# Altium schematic sheet uC.SchDoc: uC
size A3; SheetNumber: 4
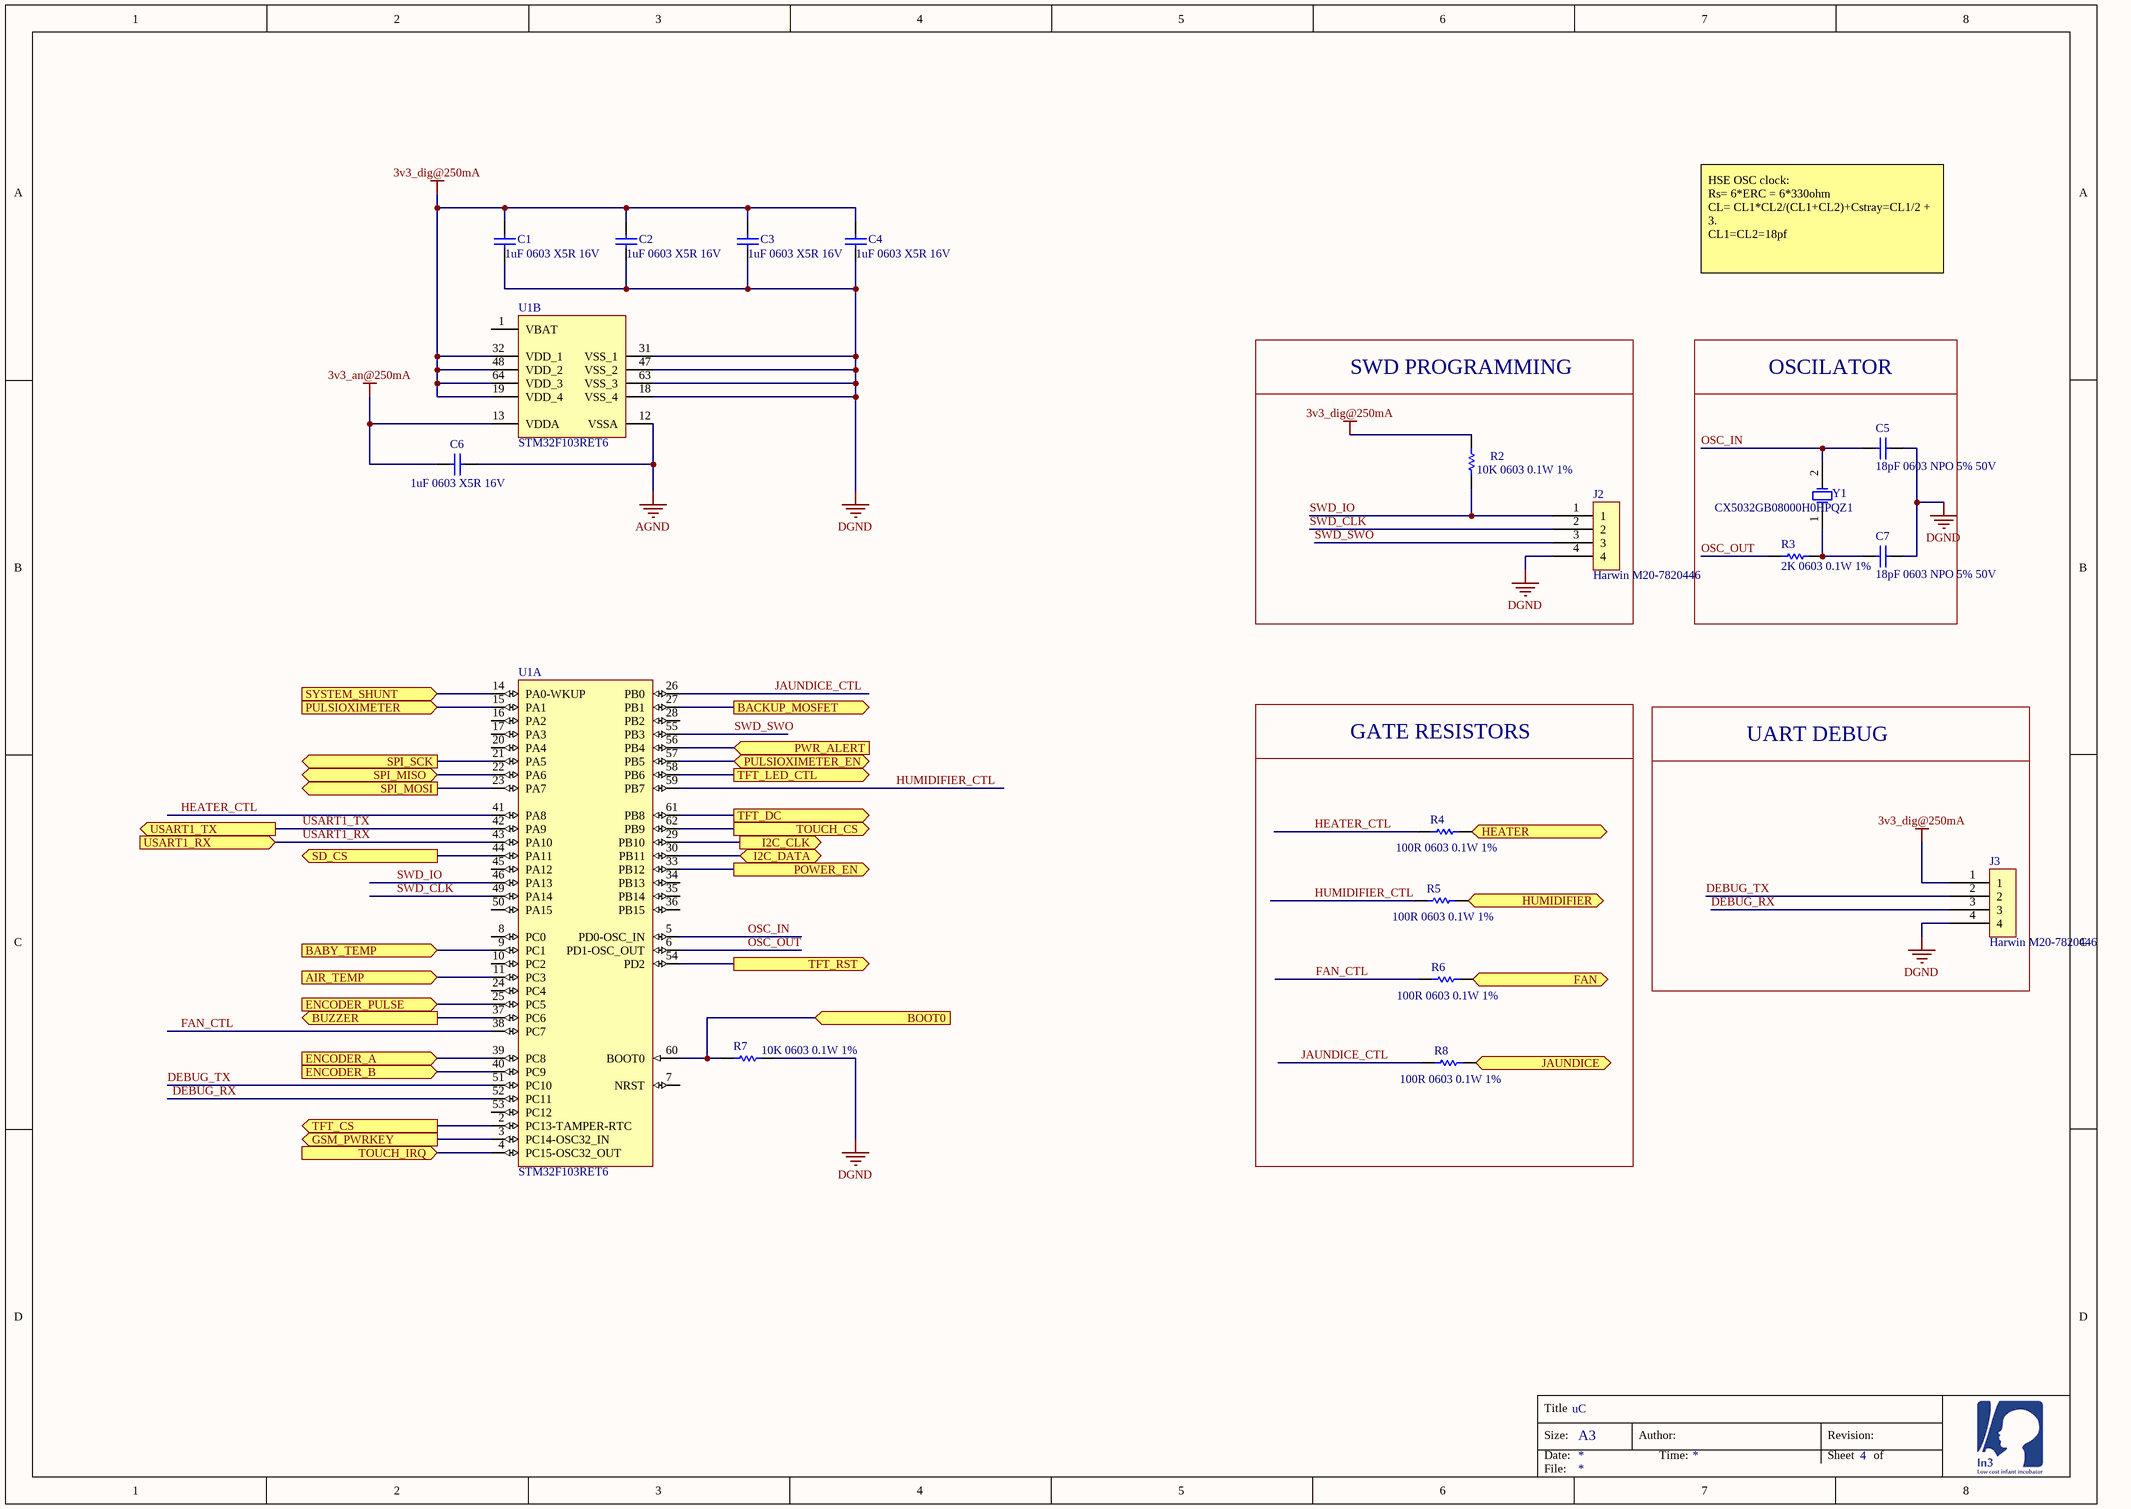
[diagram p0: uC.SchDoc]

## Parts
(Parts that share a designator on the sheet are numbered #1, #2 ... from top to bottom, then left to right.)
C1  1uF 0603 X5R 16V  [CAPC1608X60X35NL10T15]
C2  1uF 0603 X5R 16V  [CAPC1608X60X35NL10T15]
C3  1uF 0603 X5R 16V  [CAPC1608X60X35NL10T15]
C4  1uF 0603 X5R 16V  [CAPC1608X60X35NL10T15]
C5  18pF 0603 NPO 5% 50V  [CAPC1608X60X35NL10T15]
C6  1uF 0603 X5R 16V  [CAPC1608X60X35ML10T15]
C7  18pF 0603 NPO 5% 50V  [CAPC1608X60X35NL10T15]
J2  Harwin M20-7820446  [PCB-tt6oa92k1i3euqam155k-1]
J3  Harwin M20-7820446  [PCB-tt6oa92k1i3euqam155k-1]
R2  10K 0603 0.1W 1%  [RESC1609X55X30ML10T20]
R3  2K 0603 0.1W 1%  [RESC1609X55X30ML10T20]
R4  100R 0603 0.1W 1%  [RESC1609X55X30ML10T20]
R5  100R 0603 0.1W 1%  [RESC1609X55X30ML10T20]
R6  100R 0603 0.1W 1%  [RESC1609X55X30ML10T20]
R7  10K 0603 0.1W 1%  [RESC1609X55X30ML10T20]
R8  100R 0603 0.1W 1%  [RESC1609X55X30ML10T20]
U1#1  STM32F103RET6  [STM-LQFP64_L]  (part B of 2)
U1#2  STM32F103RET6  [STM-LQFP64_L]  (part A of 2)
Y1  CX5032GB08000H0HPQZ1  [PCB-mm1uo60gbc5oxcl0fq61-1]

## Blocks framed on the sheet
SWD PROGRAMMING: J2 R2
OSCILATOR: C5 C7 R3 Y1
GATE RESISTORS: R4-R6 R8
UART DEBUG: J3

## Ports
AIR_TEMP (in), BABY_TEMP (in), BACKUP_MOSFET (out), BOOT0 (in), BUZZER (out), ENCODER_A (in), ENCODER_B (in), ENCODER_PULSE (in), FAN (out), GSM_PWRKEY (out), HEATER (out), HUMIDIFIER (out), I2C_CLK (out), I2C_DATA (bidir), JAUNDICE (out), POWER_EN (out), PULSIOXIMETER (in), PULSIOXIMETER_EN, PWR_ALERT (in), SD_CS (out), SPI_MISO, SPI_MOSI (out), SPI_SCK (out), SYSTEM_SHUNT (in), TFT_CS (out), TFT_DC (out), TFT_LED_CTL (out), TFT_RST (out), TOUCH_CS (out), TOUCH_IRQ (in), USART1_RX (in), USART1_TX (out)

## Nets
3v3_an@250mA: C6.1 U1#1.13(VDDA)
3v3_dig@250mA: C1.1 C2.1 C3.1 C4.1 J3.1 R2.1 U1#1.19(VDD_4) U1#1.32(VDD_1) U1#1.48(VDD_2) U1#1.64(VDD_3)
AGND: C6.2 U1#1.12(VSSA)
DGND: C1.2 C2.2 C3.2 C4.2 C5.2 C7.2 J2.4 J3.4 R7.2 U1#1.18(VSS_4) U1#1.31(VSS_1) U1#1.47(VSS_2) U1#1.63(VSS_3)
AIR_TEMP: U1#2.11(PC3) ; port AIR_TEMP
BABY_TEMP: U1#2.9(PC1) ; port BABY_TEMP
BACKUP_MOSFET: U1#2.27(PB1) ; port BACKUP_MOSFET
BOOT0: R7.1 U1#2.60(BOOT0) ; port BOOT0
BUZZER: U1#2.37(PC6) ; port BUZZER
DEBUG_RX: J3.3 U1#2.52(PC11)
DEBUG_TX: J3.2 U1#2.51(PC10)
ENCODER_A: U1#2.39(PC8) ; port ENCODER_A
ENCODER_B: U1#2.40(PC9) ; port ENCODER_B
ENCODER_PULSE: U1#2.25(PC5) ; port ENCODER_PULSE
FAN: R6.1 ; port FAN
FAN_CTL: R6.2 U1#2.38(PC7)
GSM_PWRKEY: U1#2.3(PC14-OSC32_IN) ; port GSM_PWRKEY
HEATER: R4.1 ; port HEATER
HEATER_CTL: R4.2 U1#2.41(PA8)
HUMIDIFIER: R5.1 ; port HUMIDIFIER
HUMIDIFIER_CTL: R5.2 U1#2.59(PB7)
I2C_CLK: U1#2.29(PB10) ; port I2C_CLK
I2C_DATA: U1#2.30(PB11) ; port I2C_DATA
JAUNDICE: R8.1 ; port JAUNDICE
JAUNDICE_CTL: R8.2 U1#2.26(PB0)
OSC_IN: C5.1 U1#2.5(PD0-OSC_IN) Y1.2(OSC2)
OSC_OUT: R3.2 U1#2.6(PD1-OSC_OUT)
POWER_EN: U1#2.33(PB12) ; port POWER_EN
PULSIOXIMETER: U1#2.15(PA1) ; port PULSIOXIMETER
PULSIOXIMETER_EN: U1#2.57(PB5) ; port PULSIOXIMETER_EN
PWR_ALERT: U1#2.56(PB4) ; port PWR_ALERT
SD_CS: U1#2.44(PA11) ; port SD_CS
SPI_MISO: U1#2.22(PA6) ; port SPI_MISO
SPI_MOSI: U1#2.23(PA7) ; port SPI_MOSI
SPI_SCK: U1#2.21(PA5) ; port SPI_SCK
SWD_CLK: J2.2 U1#2.49(PA14)
SWD_IO: J2.1 R2.2 U1#2.46(PA13)
SWD_SWO: J2.3 U1#2.55(PB3)
SYSTEM_SHUNT: U1#2.14(PA0-WKUP) ; port SYSTEM_SHUNT
TFT_CS: U1#2.2(PC13-TAMPER-RTC) ; port TFT_CS
TFT_DC: U1#2.61(PB8) ; port TFT_DC
TFT_LED_CTL: U1#2.58(PB6) ; port TFT_LED_CTL
TFT_RST: U1#2.54(PD2) ; port TFT_RST
TOUCH_CS: U1#2.62(PB9) ; port TOUCH_CS
TOUCH_IRQ: U1#2.4(PC15-OSC32_OUT) ; port TOUCH_IRQ
USART1_RX: U1#2.43(PA10) ; port USART1_RX
USART1_TX: U1#2.42(PA9) ; port USART1_TX
NetC7_1: C7.1 R3.1 Y1.1(OSC1)

Not connected (* = marked no-connect by the designer): U1#1 1(VBAT); U1#2 7(NRST) 8(PC0) 10(PC2) 16(PA2) 17(PA3) 20(PA4) 24(PC4) 28(PB2) 34(PB13) 35(PB14) 36(PB15) 45(PA12) 50(PA15) 53(PC12)

## Notes on the sheet
- HSE OSC clock:
  Rs= 6*ERC = 6*330ohm
  CL= CL1*CL2/(CL1+CL2)+Cstray=CL1/2 + 3.
  CL1=CL2=18pf
- Title
- Size:
- Date:
- A3
- Author:
- Time:
- Revision:
- Sheet
- of
- File:

## Library data of the parts
C1-C4 C6 = CMP-119984-2: Manufacturer Part Number: GRM185R61C105KE44D; Capacitance Tolerance: ±10%; Case/Package (in): 0603; Lead-Free Status: Lead Free; Capacitance: 1uF; Dielectric Characteristic: X5R; Lifecycle Status: Active; Mounting Style: Surface Mount; Number of Pins: 2; Octopart Url: https://octopart.com/grm185r61c105ke44d-murata-197446; OctopartID: de3e1737f81e01f9; REACH SVHC Compliance: No SVHC; RoHS: Compliant; Size-Height: 0.0005 m; Size-Length: 0.0016 m; Size-Thickness: 0.0005 m; Size-Width: 0.0008 m; Rated voltage: 16V
C5 C7 = CMP-35cbf9f8b0acea0c-1: Manufacturer Part Number: C0603C180K5RACTU; Capacitance: 18.0 pF; Capacitance Tolerance: ±10%; Dielectric Characteristic: X7R; Dielectric Material: Ceramic; Lead-Free Status: R; Voltage Rating (DC): 50.0 V; Octopart URL: https://octopart.com/c0603c180k5racauto-kemet-87662593; Case/Package: 0603; Mounting Style: Surface Mount; Operating Temperature: -55.0 °C (min); RoHS: Compliant; OctopartID: 35cbf9f8b0acea0c
J2 J3 = CMP-2481958-5: Conn Socket Strip SKT 4 POS 2.54mm Solder ST Thru-Hole Tube; Number of Contacts: 4; Current Rating: 3.00 A; Insulation Resistance: 1.00 MΩ; Number of Mating Cycles: 50; Gender: Female; Contact Resistance: 15.0 mΩ; Contact Material: Phosphor Bronze; Number of Rows: 1; OctopartID: 0d9ac4c1d3c6d25d; Pin Pitch: 2.54 mm; Octopart URL: http://octopart.com/m20-7820446-harwin-5372730; RoHS: Compliant; REACH SVHC Compliance: No SVHC; Contact Plating: Tin; Mounting Style: Through Hole, Vertical; Manufacturer Part Number: M20-7820446; DNP: DNP
R2 R7 = CMP-4716590-9: Octopart Url: https://octopart.com/crcw060310k0fkeahp-vishay-42634028; package: 0603; Resistance: 10k; Tolerance: 1%
R3 = CMP-3655986-6: Resistance: 2K; Tolerance: 1%; package: 0603
R4-R6 R8 = CMP-a61f6f36030f79d8-4: Manufacturer Part Number: ERJ3GEYJ101V; Power Rating: 100 mW; Resistance: 1k; Case/Package (SI): 1608; Voltage Rating (DC): 50.0 V; Temperature Coefficient: -100 ppm/°C to 100 ppm/°C; REACH SVHC Compliance: No SVHC; Packaging: Tape & Reel (TR), Cut Tape (CT); Resistance Tolerance: ±1%; RoHS: Compliant; Mounting Style: Surface Mount; Number of Pins: 2; Size-Length: 1.60 mm; Octopart URL: https://octopart.com/cr0603-fx-1001elf-bourns-2326646; Size-Thickness: 457 µm; OctopartID: a61f6f36030f79d8; Size-Width: 787 µm; Case/Package: 0603
U1#1 U1#2 = CMP-2386707-4: ARM Cortex-M3 32-bit MCU, 512 KB Flash, 64 KB Internal RAM, 51 I/Os, 64-pin LQFP, -40 to 85 degC, Tray; Clock Speed: 72000000.0 Hz; FLASH Memory Size: 524288 B; Lead-Free Status: Lead Free; Number of Bits: 32; RAM Memory Size: 65536 B; Lifecycle Status: Active; Mounting Style: Surface Mount; Number of Pins: 64; Octopart Url: https://octopart.com/stm32f103ret6-stmicroelectronics-8119628; OctopartID: bab873c97a92657f; REACH SVHC Compliance: No SVHC; RoHS: Compliant
Y1 = CMP-4fdd8615a0ef901a-1: Crystal 8Mhz 30ppm -40ºC/+85ºC 12pF 300ohm; Manufacturer Part Number: CX5032GB08000H0HPQZ1; Packaging: Reel; Mounting Style: Surface Mount